# EAGLE design 701_i2c_expand (EAGLE 7.6.0)
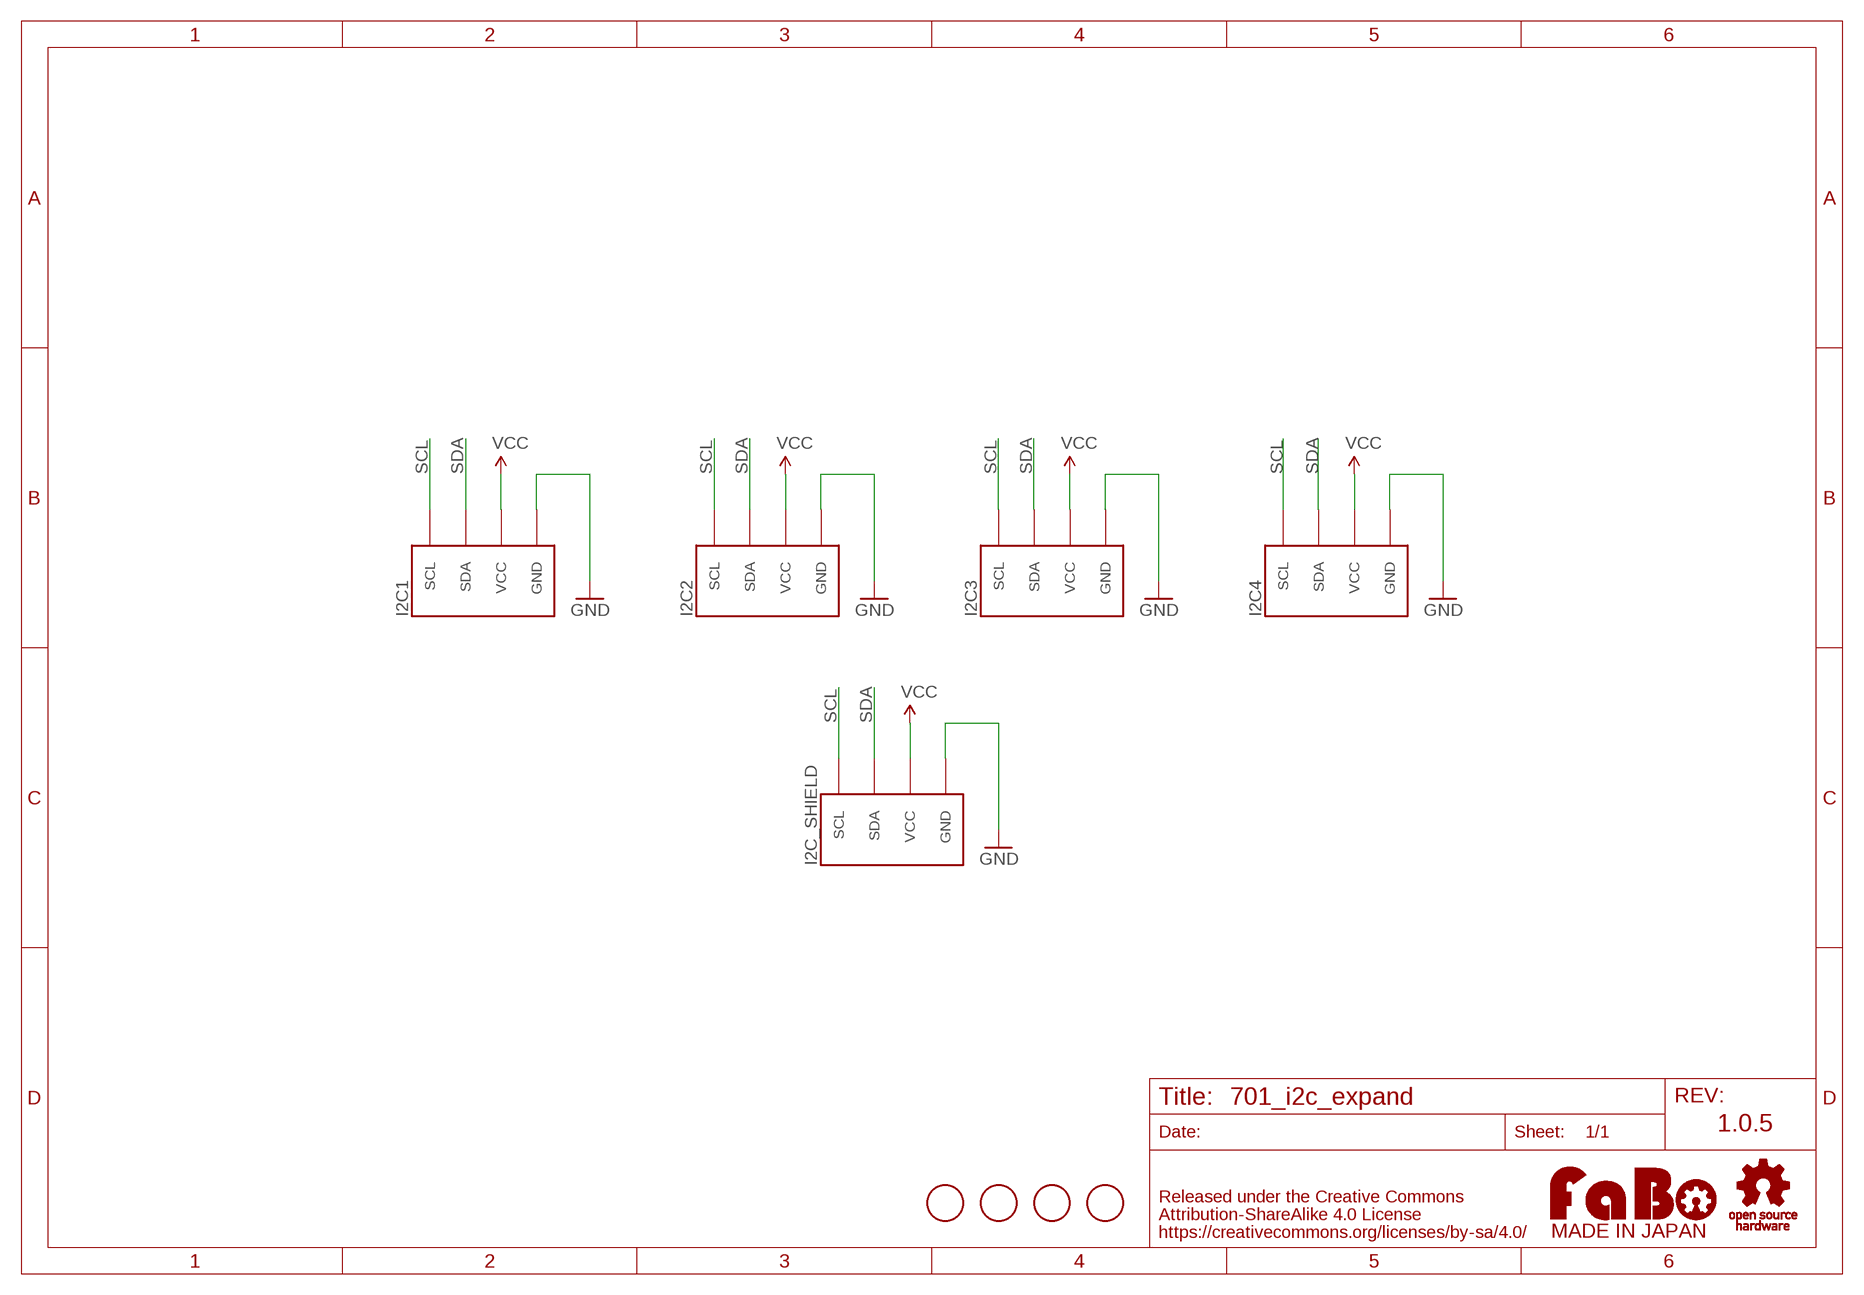
[diagram p0: schematic, sheet 1]

## Parts
I2C1  FABO_BRICK_I2C-S04B-PASK-2_LONG  [FABO_BRICK_I2C_S04B-PASK-2_LONG]
I2C2  FABO_BRICK_I2C-S04B-PASK-2_LONG  [FABO_BRICK_I2C_S04B-PASK-2_LONG]
I2C3  FABO_BRICK_I2C-S04B-PASK-2_LONG  [FABO_BRICK_I2C_S04B-PASK-2_LONG]
I2C4  FABO_BRICK_I2C-S04B-PASK-2_LONG  [FABO_BRICK_I2C_S04B-PASK-2_LONG]
I2C_SHIELD  FABO_BRICK_I2C-S04B-PASK-2_LONG  [FABO_BRICK_I2C_S04B-PASK-2_LONG]
U$7  SCREW-PAD-3MM  [SCREWPAD_3MM]
U$8  SCREW-PAD-3MM  [SCREWPAD_3MM]
U$9  SCREW-PAD-3MM  [SCREWPAD_3MM]
U$10  SCREW-PAD-3MM  [SCREWPAD_3MM]
U$11  LOGO_OSHW-M_BOTTOM  [LOGO_OSHW_M_BOTTOM]
U$12  LOGO_FABO-M  [LOGO_FABO_MS]

## Nets
GND: I2C1.GND I2C2.GND I2C3.GND I2C4.GND I2C_SHIELD.GND
SCL: I2C1.SCL I2C2.SCL I2C3.SCL I2C4.SCL I2C_SHIELD.SCL
SDA: I2C1.SDA I2C2.SDA I2C3.SDA I2C4.SDA I2C_SHIELD.SDA
VCC: I2C1.VCC I2C2.VCC I2C3.VCC I2C4.VCC I2C_SHIELD.VCC

## Notes on the sheet
- 1.0.5

## Library data of the parts
I2C1-I2C4 I2C_SHIELD = FaBo-Template:FABO_BRICK_I2C: FaBo Brick I2C
U$7-U$10 = gclue:SCREW-PAD
U$11 = FaBo-etc:LOGO_OSHW
U$12 = FaBo-etc:LOGO_FABO

## Board
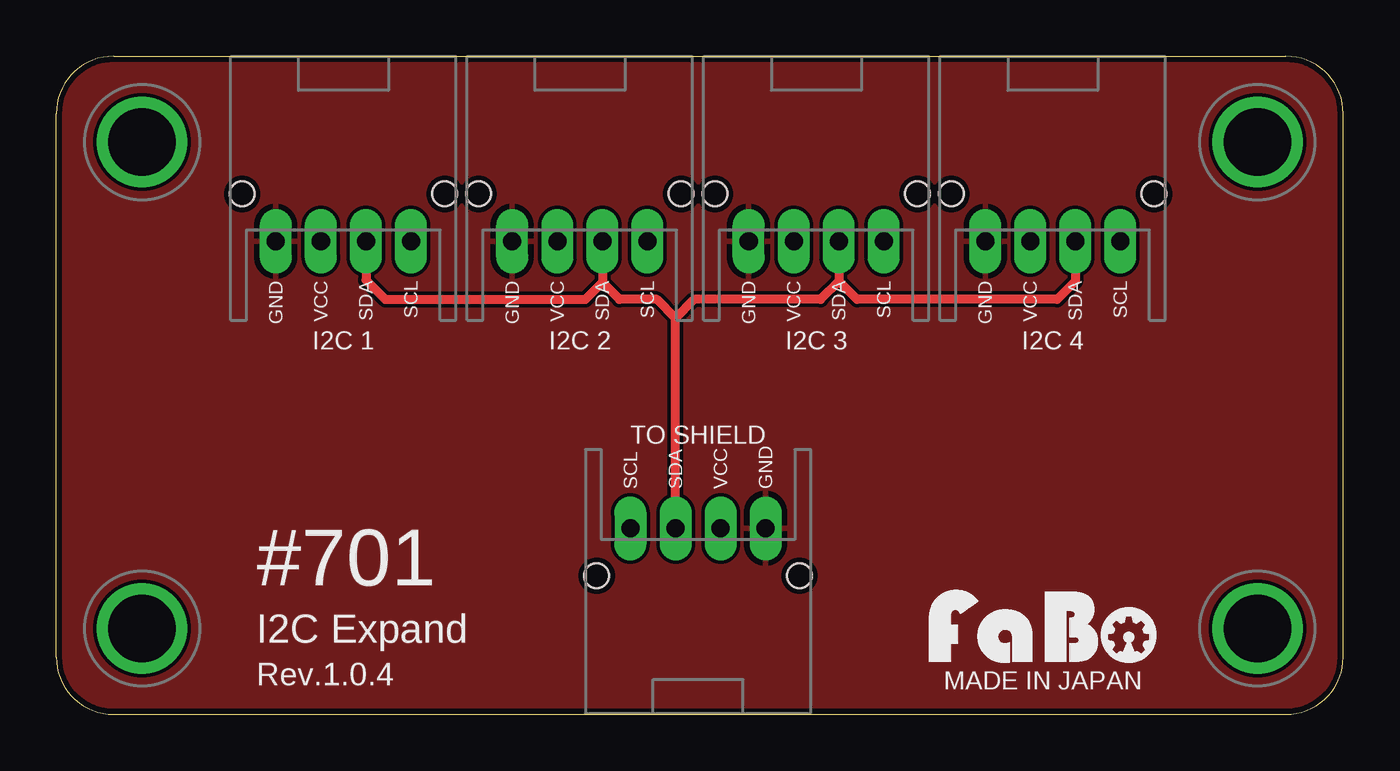
[diagram p1: board, top side]
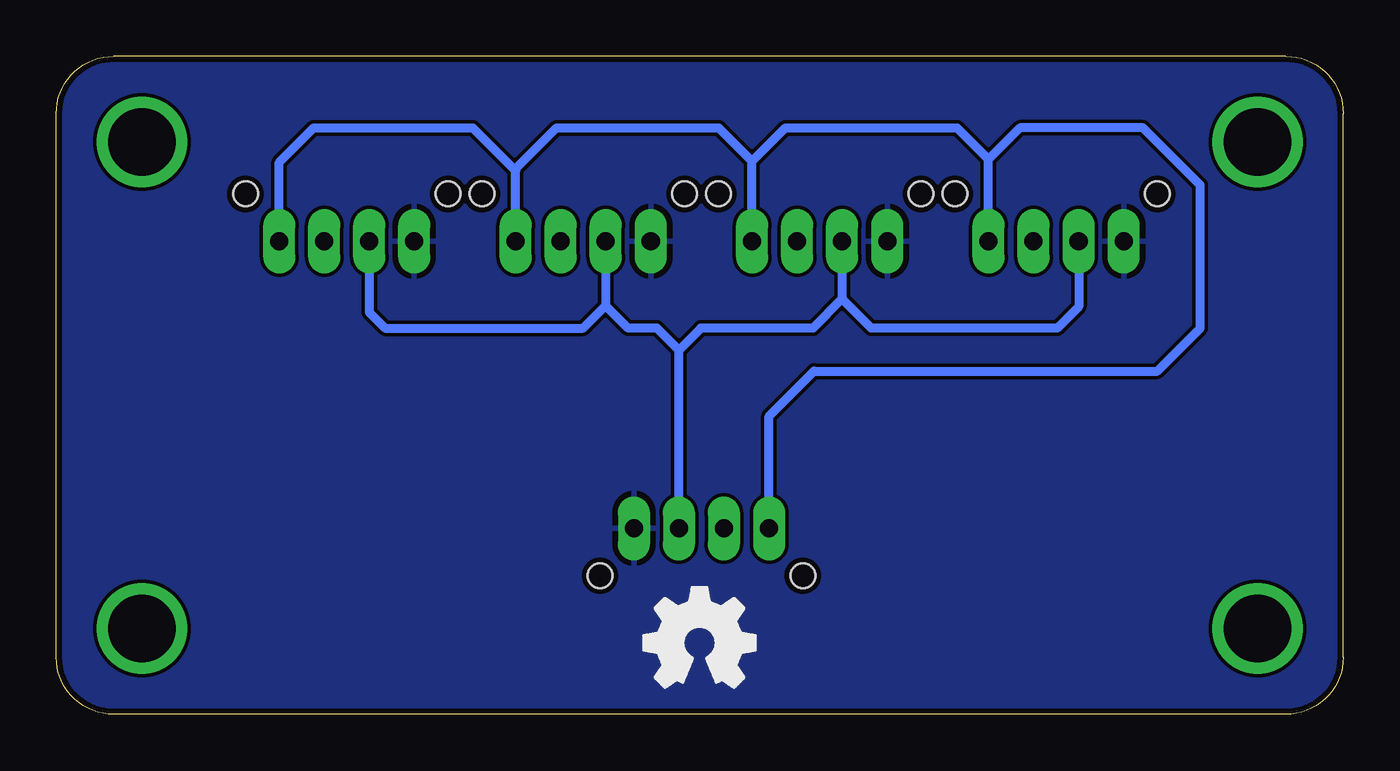
[diagram p2: board, bottom side, seen from below]

Size 57.15 x 29.21 mm. Coordinates in mm from the lower left corner, seen from the top.
Outline: 2.54,0 54.61,0 arc90 57.15,2.54 57.15,26.67 arc90 54.61,29.21 2.54,29.21 arc90 0,26.67 0,2.54 arc90 2.54,0
Copper layers (1*16): Top 0.035mm / dielectric 1.5mm / Bottom 0.035mm
Design rules "SeeedStudio_2layer_DRU_no_angle_20140221": minimum track width 6mil, minimum drill 12mil, track to track 6mil, track to pad 6mil, pad to pad 6mil, via to via 6mil, smd to smd 0mil, copper to edge 10mil, drill to drill 10mil, minimum pad ring 10mil, minimum via ring 6mil, stop-mask expansion 2mil, vias tented up to drill 100mil, thermal gap 10mil

### Footprints (pad centres in the part's own frame; a part is rotated, then mirrored left to right if it is on the bottom)
FABO_BRICK_I2C_S04B-PASK-2_LONG = drill 0.8 pad 1.422 long: GND -3,0; SCL 3,0; SDA 1,0; VCC -1,0 | hole 1.1: 4.5,2.1; -4.5,2.1
SCREWPAD_3MM = drill 3 pad 3.81: 1 0,0

### Placement (x,y rotation side)
I2C1  12.75,21 0 top
I2C2  23.25,21 0 top
I2C3  33.75,21 0 top
I2C4  44.25,21 0 top
I2C_SHIELD  28.5,8.25 180 top
U$7  3.81,3.81 0 top
U$8  3.81,25.4 0 top
U$9  53.34,25.4 0 top
U$10  53.34,3.81 0 top
U$11  28.57,3.17 0 top
U$12  43.81,1.91 0 top

### Tracks (layer width: path | path; a pad name or v marks a point on that pad's centre or on a via)
GND
  pour Bottom: 0,0 57.78,0 57.78,30.48 0,30.48
  pour Top: 0,0 57.78,0 57.78,30.48 0,30.48
SCL
  Bottom 0.406: I2C1.SCL 15.75,24.64 | 15.75,24.64 17.14,26.04 24.77,26.04 26.25,24.55 | I2C2.SCL 26.25,24.55 | I2C3.SCL 36.75,24.13 | 36.75,24.13 36.75,24.21 34.92,26.04 27.73,26.04 26.25,24.55 | I2C4.SCL 47.25,24.5 45.72,26.04 38.66,26.04 36.75,24.13 | I2C_SHIELD.SCL 25.5,13.23 23.5,15.24 8.26,15.24 6.35,17.14 6.35,23.5 8.89,26.04 14.36,26.04 15.75,24.64
SDA
  Top 0.406: I2C1.SDA 13.75,19.27 14.61,18.41 23.5,18.41 24.25,19.17 | I2C2.SDA 24.25,19.17 | 24.25,19.17 25,18.41 26.67,18.41 27.5,17.59 | I2C4.SDA 45.25,19.21 44.45,18.41 35.56,18.41 34.75,19.23 | I2C3.SDA 34.75,19.23 | 34.75,19.23 33.94,18.41 28.33,18.41 27.5,17.59 | I2C_SHIELD.SDA 27.5,17.59
VCC
  Bottom 0.406: I2C1.VCC 11.75,18.09 12.7,17.14 20.95,17.14 22.25,18.44 | I2C2.VCC 22.25,18.44 | I2C3.VCC 32.75,18.14 | 32.75,18.14 31.75,17.14 30.48,17.14 29.5,16.16 | 22.25,18.44 23.55,17.14 28.52,17.14 29.5,16.16 | I2C4.VCC 43.25,17.85 42.55,17.14 33.75,17.14 32.75,18.14 | I2C_SHIELD.VCC 29.5,16.16

### Text on the board
tPlace: GND | VCC | SDA | SCL | GND | VCC | SDA | SCL | GND | VCC | SDA | SCL | GND | VCC | SDA | SCL | I2C 1 | I2C 2 | I2C 3 | I2C 4 | TO SHIELD | SCL | SDA | VCC | GND | #701 | I2C Expand | MADE IN JAPAN | Rev.1.0.4